# EAGLE design PGTN021_octasource_controls (EAGLE 9.5.0)
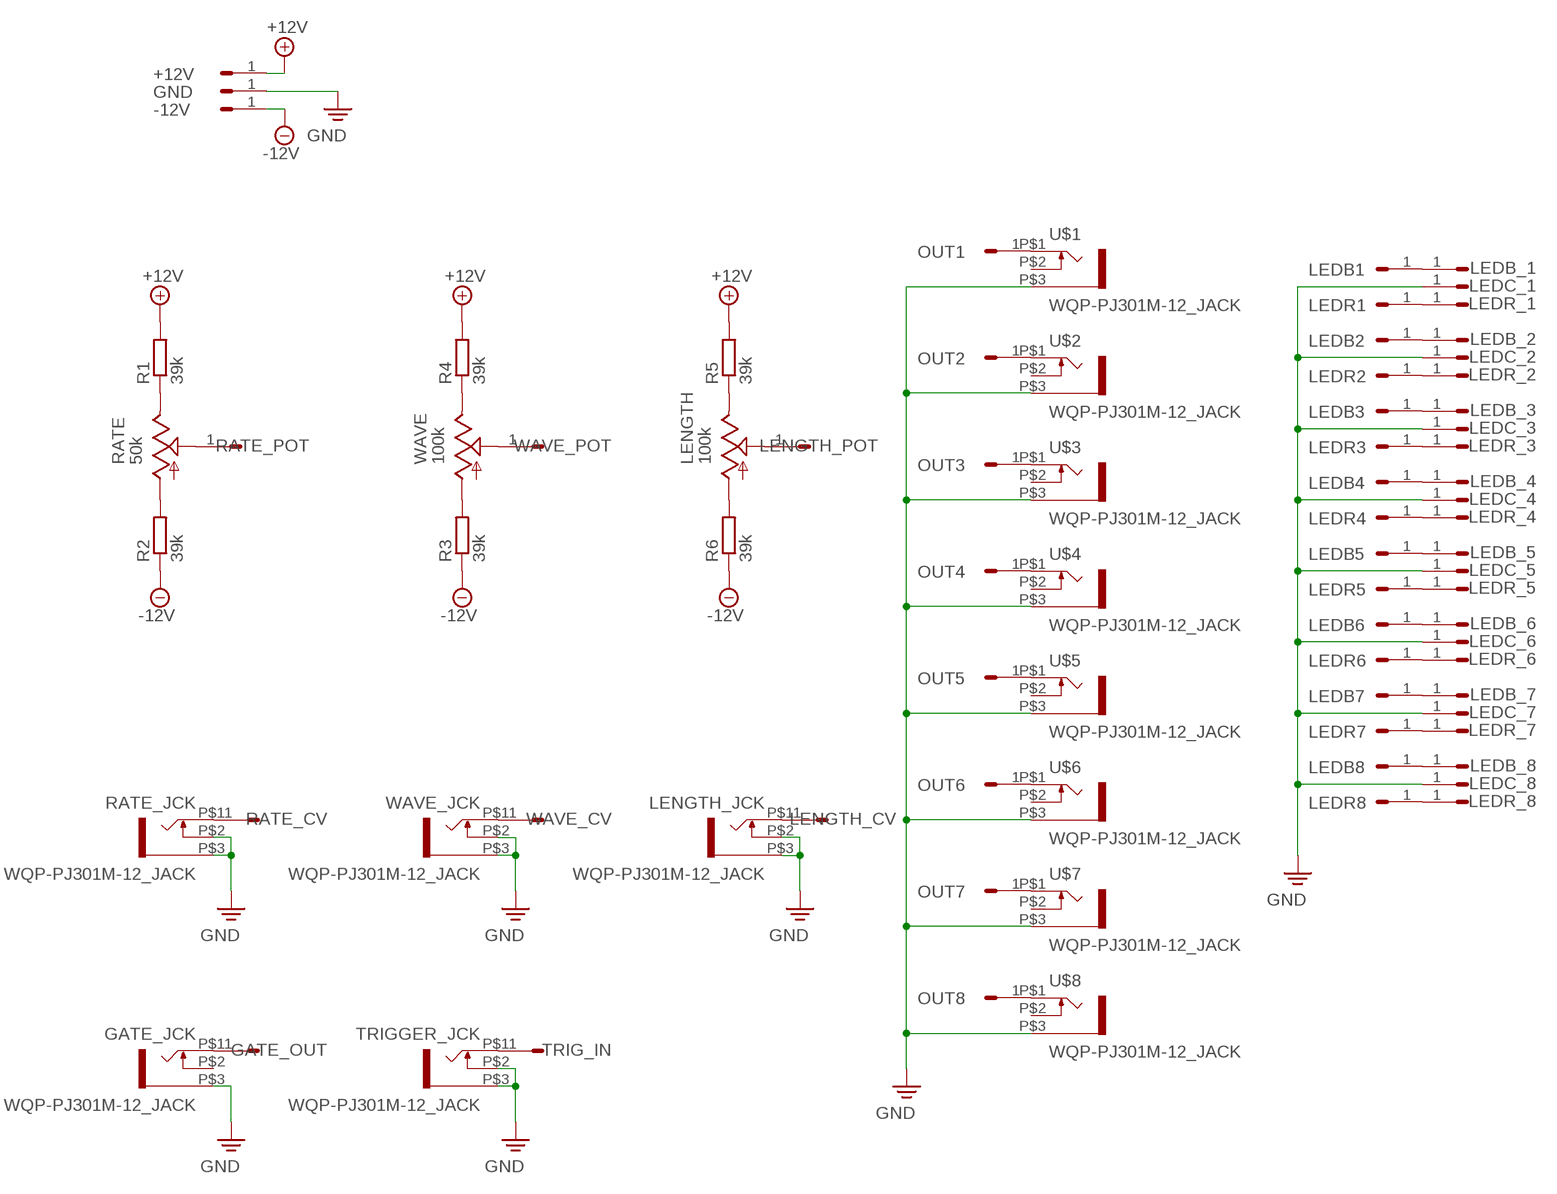
[diagram p0: schematic, sheet 1]

## Parts
+12V  HEADER/MALE/01  [HEADER/MALE/01]
-12V  HEADER/MALE/01  [HEADER/MALE/01]
GATE_JCK  WQP-PJ301M-12_JACK  [WQP-PJ301M-12_JACK]
GATE_OUT  HEADER/MALE/01  [HEADER/MALE/01]
GND  HEADER/MALE/01  [HEADER/MALE/01]
LEDB1  HEADER/MALE/01  [HEADER/MALE/01]
LEDB2  HEADER/MALE/01  [HEADER/MALE/01]
LEDB3  HEADER/MALE/01  [HEADER/MALE/01]
LEDB4  HEADER/MALE/01  [HEADER/MALE/01]
LEDB5  HEADER/MALE/01  [HEADER/MALE/01]
LEDB6  HEADER/MALE/01  [HEADER/MALE/01]
LEDB7  HEADER/MALE/01  [HEADER/MALE/01]
LEDB8  HEADER/MALE/01  [HEADER/MALE/01]
LEDB_1  HEADER/MALE/01  [HEADER/MALE/01]
LEDB_2  HEADER/MALE/01  [HEADER/MALE/01]
LEDB_3  HEADER/MALE/01  [HEADER/MALE/01]
LEDB_4  HEADER/MALE/01  [HEADER/MALE/01]
LEDB_5  HEADER/MALE/01  [HEADER/MALE/01]
LEDB_6  HEADER/MALE/01  [HEADER/MALE/01]
LEDB_7  HEADER/MALE/01  [HEADER/MALE/01]
LEDB_8  HEADER/MALE/01  [HEADER/MALE/01]
LEDC_1  HEADER/MALE/01  [HEADER/MALE/01]
LEDC_2  HEADER/MALE/01  [HEADER/MALE/01]
LEDC_3  HEADER/MALE/01  [HEADER/MALE/01]
LEDC_4  HEADER/MALE/01  [HEADER/MALE/01]
LEDC_5  HEADER/MALE/01  [HEADER/MALE/01]
LEDC_6  HEADER/MALE/01  [HEADER/MALE/01]
LEDC_7  HEADER/MALE/01  [HEADER/MALE/01]
LEDC_8  HEADER/MALE/01  [HEADER/MALE/01]
LEDR1  HEADER/MALE/01  [HEADER/MALE/01]
LEDR2  HEADER/MALE/01  [HEADER/MALE/01]
LEDR3  HEADER/MALE/01  [HEADER/MALE/01]
LEDR4  HEADER/MALE/01  [HEADER/MALE/01]
LEDR5  HEADER/MALE/01  [HEADER/MALE/01]
LEDR6  HEADER/MALE/01  [HEADER/MALE/01]
LEDR7  HEADER/MALE/01  [HEADER/MALE/01]
LEDR8  HEADER/MALE/01  [HEADER/MALE/01]
LEDR_1  HEADER/MALE/01  [HEADER/MALE/01]
LEDR_2  HEADER/MALE/01  [HEADER/MALE/01]
LEDR_3  HEADER/MALE/01  [HEADER/MALE/01]
LEDR_4  HEADER/MALE/01  [HEADER/MALE/01]
LEDR_5  HEADER/MALE/01  [HEADER/MALE/01]
LEDR_6  HEADER/MALE/01  [HEADER/MALE/01]
LEDR_7  HEADER/MALE/01  [HEADER/MALE/01]
LEDR_8  HEADER/MALE/01  [HEADER/MALE/01]
LENGTH  100k  9MM_SNAP-IN_POT_  [9MM_SNAP-IN_POT]
LENGTH_CV  HEADER/MALE/01  [HEADER/MALE/01]
LENGTH_JCK  WQP-PJ301M-12_JACK  [WQP-PJ301M-12_JACK]
LENGTH_POT  HEADER/MALE/01  [HEADER/MALE/01]
OUT1  HEADER/MALE/01  [HEADER/MALE/01]
OUT2  HEADER/MALE/01  [HEADER/MALE/01]
OUT3  HEADER/MALE/01  [HEADER/MALE/01]
OUT4  HEADER/MALE/01  [HEADER/MALE/01]
OUT5  HEADER/MALE/01  [HEADER/MALE/01]
OUT6  HEADER/MALE/01  [HEADER/MALE/01]
OUT7  HEADER/MALE/01  [HEADER/MALE/01]
OUT8  HEADER/MALE/01  [HEADER/MALE/01]
R1  39k  RESISTORRESISTOR/UPRIGHT/7.5  [RESISTOR/7.5]
R2  39k  RESISTORRESISTOR/UPRIGHT/7.5  [RESISTOR/7.5]
R3  39k  RESISTORRESISTOR/UPRIGHT/7.5  [RESISTOR/7.5]
R4  39k  RESISTORRESISTOR/UPRIGHT/7.5  [RESISTOR/7.5]
R5  39k  RESISTORRESISTOR/UPRIGHT/7.5  [RESISTOR/7.5]
R6  39k  RESISTORRESISTOR/UPRIGHT/7.5  [RESISTOR/7.5]
RATE  50k  9MM_SNAP-IN_POT_  [9MM_SNAP-IN_POT]
RATE_CV  HEADER/MALE/01  [HEADER/MALE/01]
RATE_JCK  WQP-PJ301M-12_JACK  [WQP-PJ301M-12_JACK]
RATE_POT  HEADER/MALE/01  [HEADER/MALE/01]
TRIG_IN  HEADER/MALE/01  [HEADER/MALE/01]
TRIGGER_JCK  WQP-PJ301M-12_JACK  [WQP-PJ301M-12_JACK]
U$1  WQP-PJ301M-12_JACK  [WQP-PJ301M-12_JACK]
U$2  WQP-PJ301M-12_JACK  [WQP-PJ301M-12_JACK]
U$3  WQP-PJ301M-12_JACK  [WQP-PJ301M-12_JACK]
U$4  WQP-PJ301M-12_JACK  [WQP-PJ301M-12_JACK]
U$5  WQP-PJ301M-12_JACK  [WQP-PJ301M-12_JACK]
U$6  WQP-PJ301M-12_JACK  [WQP-PJ301M-12_JACK]
U$7  WQP-PJ301M-12_JACK  [WQP-PJ301M-12_JACK]
U$8  WQP-PJ301M-12_JACK  [WQP-PJ301M-12_JACK]
WAVE  100k  9MM_SNAP-IN_POT_  [9MM_SNAP-IN_POT]
WAVE_CV  HEADER/MALE/01  [HEADER/MALE/01]
WAVE_JCK  WQP-PJ301M-12_JACK  [WQP-PJ301M-12_JACK]
WAVE_POT  HEADER/MALE/01  [HEADER/MALE/01]

## Nets
+12V: +12V.1 R1.2 R4.2 R5.2
-12V: -12V.1 R2.1 R3.1 R6.1
N$1: R2.2 RATE.1(A)
N$2: R1.1 RATE.3(E)
N$3: RATE_CV.1 RATE_JCK.P$1
N$4: RATE.2(S) RATE_POT.1
N$5: R3.2 WAVE.1(A)
N$6: R4.1 WAVE.3(E)
N$7: WAVE.2(S) WAVE_POT.1
N$8: LENGTH.3(E) R5.1
N$9: LENGTH.1(A) R6.2
N$10: LENGTH.2(S) LENGTH_POT.1
N$11: LENGTH_CV.1 LENGTH_JCK.P$1
N$12: WAVE_CV.1 WAVE_JCK.P$1
N$13: GATE_JCK.P$1 GATE_OUT.1
N$14: OUT1.1 U$1.P$1
N$15: OUT2.1 U$2.P$1
N$16: OUT3.1 U$3.P$1
N$17: OUT4.1 U$4.P$1
N$18: OUT5.1 U$5.P$1
N$19: OUT6.1 U$6.P$1
N$20: OUT7.1 U$7.P$1
N$21: OUT8.1 U$8.P$1
N$22: LEDB1.1 LEDB_1.1
N$23: LEDB2.1 LEDB_2.1
N$24: LEDB3.1 LEDB_3.1
N$25: LEDB4.1 LEDB_4.1
N$26: LEDB5.1 LEDB_5.1
N$27: LEDB6.1 LEDB_6.1
N$28: LEDB7.1 LEDB_7.1
N$29: LEDB8.1 LEDB_8.1
N$30: LEDR1.1 LEDR_1.1
N$31: LEDR2.1 LEDR_2.1
N$32: LEDR3.1 LEDR_3.1
N$33: LEDR4.1 LEDR_4.1
N$34: LEDR5.1 LEDR_5.1
N$35: LEDR6.1 LEDR_6.1
N$36: LEDR7.1 LEDR_7.1
N$37: LEDR8.1 LEDR_8.1
N$38: TRIG_IN.1 TRIGGER_JCK.P$1
PE: GATE_JCK.P$3 GND.1 LEDC_1.1 LEDC_2.1 LEDC_3.1 LEDC_4.1 LEDC_5.1 LEDC_6.1 LEDC_7.1 LEDC_8.1 LENGTH_JCK.P$2 LENGTH_JCK.P$3 RATE_JCK.P$2 RATE_JCK.P$3 TRIGGER_JCK.P$2 TRIGGER_JCK.P$3 U$1.P$3 U$2.P$3 U$3.P$3 U$4.P$3 U$5.P$3 U$6.P$3 U$7.P$3 U$8.P$3 WAVE_JCK.P$2 WAVE_JCK.P$3 ; supply symbol labelled GND
Unconnected: GATE_JCK.P$2 U$1.P$2 U$2.P$2 U$3.P$2 U$4.P$2 U$5.P$2 U$6.P$2 U$7.P$2 U$8.P$2

## Library data of the parts
+12V -12V GATE_OUT GND LEDB1-LEDB8 LEDB_1-LEDB_8 LEDC_1-LEDC_8 LEDR1-LEDR8 LEDR_1-LEDR_8 LENGTH_CV LENGTH_POT OUT1-OUT8 RATE_CV RATE_POT TRIG_IN WAVE_CV WAVE_POT = connectors:HEADER/MALE/01
GATE_JCK LENGTH_JCK RATE_JCK TRIGGER_JCK U$1-U$8 WAVE_JCK = controls:WQP-PJ301M-12_JACK
LENGTH RATE WAVE = controls:9MM_SNAP-IN_POT: 9mm vertical snap-in pot, Alpha / Panasonic style
R1-R6 = resistors:RESISTOR: RESISTOR, European symbol

## Board
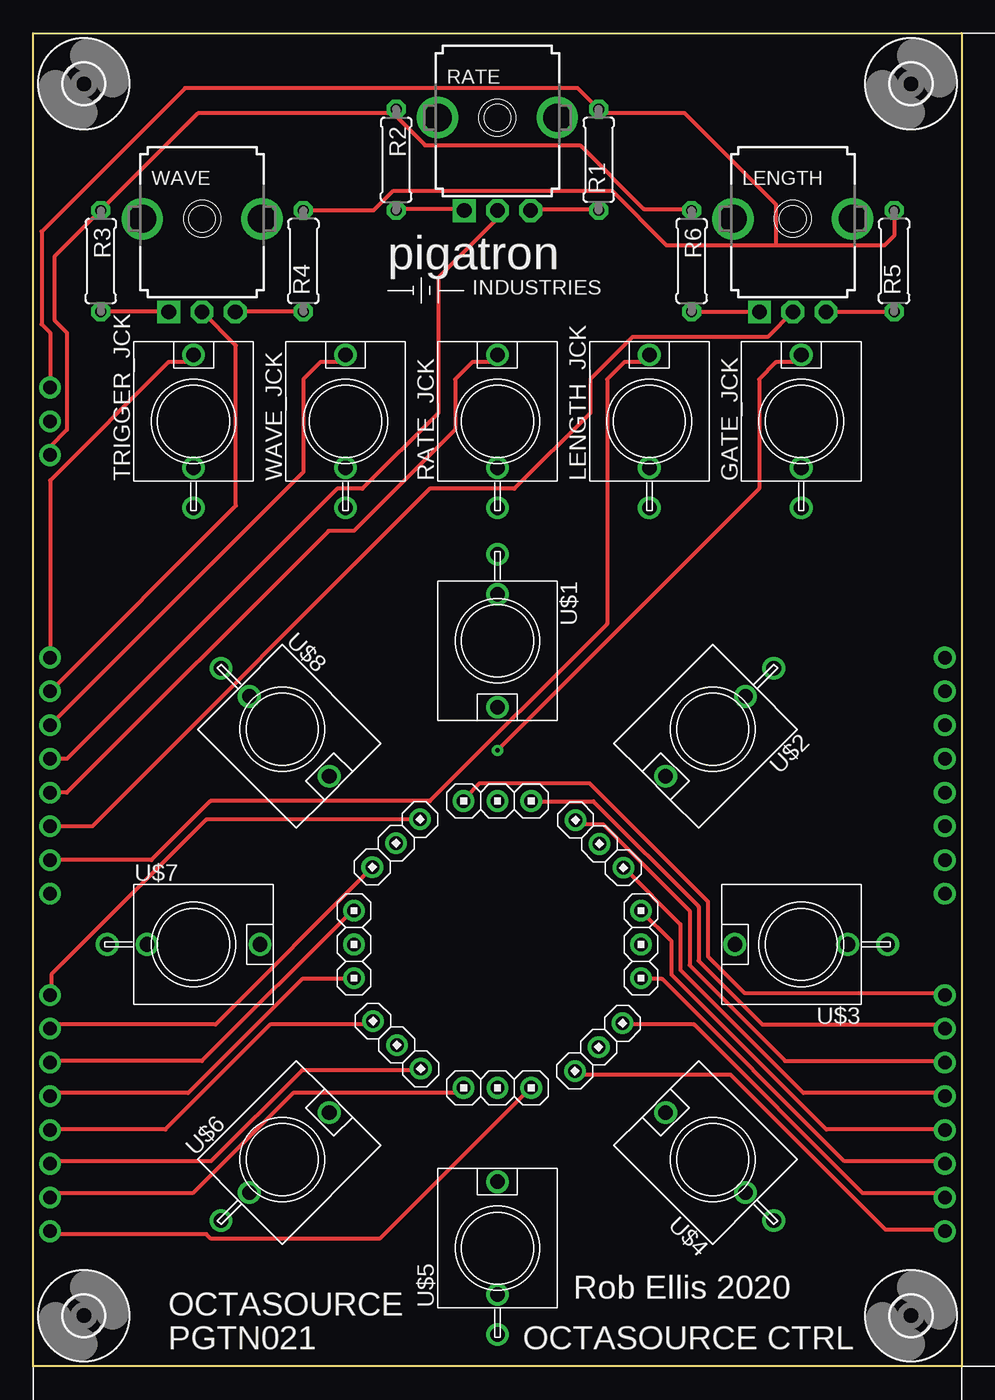
[diagram p1: board, top side]
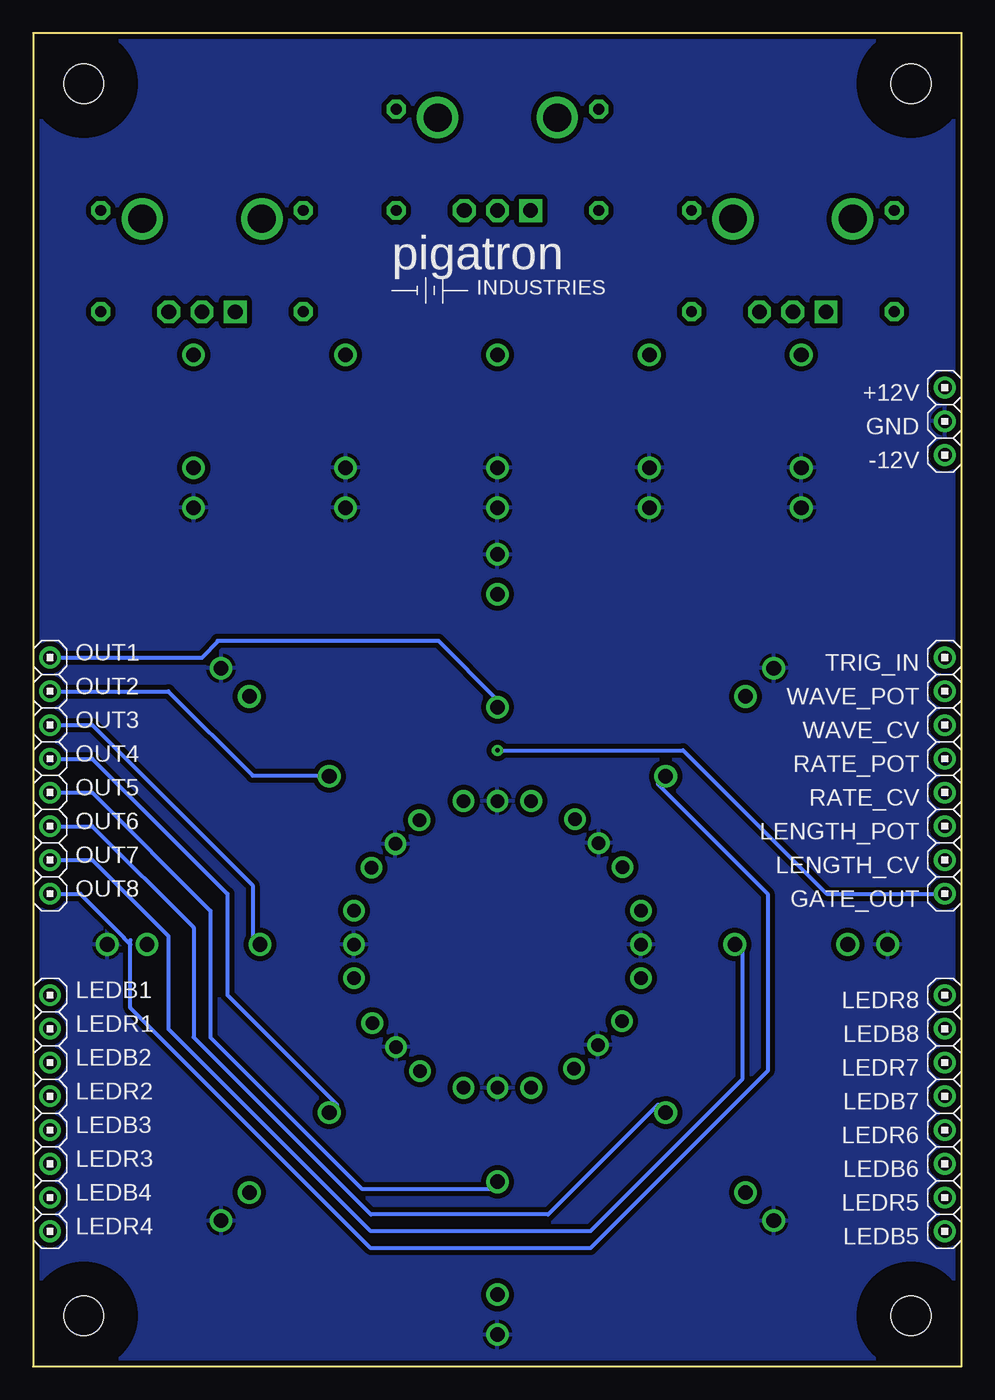
[diagram p2: board, bottom side, seen from below]

Size 69.85 x 100.33 mm. Coordinates in mm from the lower left corner, seen from the top.
Outline: 0,0 0,100.33 69.85,100.33 69.85,0 0,0
Copper layers (1*16): Top 0.0356mm / dielectric 1.5011mm / Bottom 0.0356mm
Design rules "pigatron": minimum track width 12mil, minimum drill 13mil, track to track 15mil, track to pad 10mil, pad to pad 10mil, via to via 10mil, smd to smd 6mil, copper to edge 15mil, drill to drill 10mil, minimum pad ring 12mil, minimum via ring 10mil, stop-mask expansion 4mil, vias tented up to drill 0mil, thermal gap 10mil

### Footprints (pad centres in the part's own frame; a part is rotated, then mirrored left to right if it is on the bottom)
HEADER/MALE/01 = drill 1.016: 1 0,0
WQP-PJ301M-12_JACK = drill 1.1: P$1 0,5; P$2 0,-3.5; P$3 0,-6.5
9MM_SNAP-IN_POT = drill 1.1 square: 1 -2.5,-7 | drill 1.1 octagon: 2 0,-7; 3 2.5,-7 | drill 2.1 pad 2.794: CHASSIS1 -4.5,0; CHASSIS2 4.5,0
RESISTOR/7.5 = drill 0.813 octagon: 1 -3.81,0; 2 3.81,0
STANDOFF/3.0 = hole 3: 0,0

### Placement (x,y rotation side)
+12V  1.27,73.66 180 bottom
-12V  1.27,68.58 180 bottom
GATE_JCK  57.78,71.12 0 top
GATE_OUT  1.27,35.56 180 bottom
GND  1.27,71.12 180 bottom
LEDB1  68.58,27.94 0 bottom
LEDB2  68.58,22.86 0 bottom
LEDB3  68.58,17.78 0 bottom
LEDB4  68.58,12.7 0 bottom
LEDB5  1.27,10.16 180 bottom
LEDB6  1.27,15.24 180 bottom
LEDB7  1.27,20.32 180 bottom
LEDB8  1.27,25.4 180 bottom
LEDB_1  32.38,42.55 90 top
LEDB_2  40.8,41.11 45 top
LEDB_3  45.72,34.29 0 top
LEDB_4  44.34,25.82 315 top
LEDB_5  37.47,20.95 270 top
LEDB_6  29.16,22.39 225 top
LEDB_7  24.13,29.21 180 top
LEDB_8  25.51,37.57 135 top
LEDC_1  34.92,42.55 90 top
LEDC_2  42.6,39.32 45 top
LEDC_3  45.72,31.75 0 top
LEDC_4  42.55,24.02 315 top
LEDC_5  34.92,20.95 270 top
LEDC_6  27.36,24.18 225 top
LEDC_7  24.13,31.75 180 top
LEDC_8  27.31,39.37 135 top
LEDR1  68.58,25.4 0 bottom
LEDR2  68.58,20.32 0 bottom
LEDR3  68.58,15.24 0 bottom
LEDR4  68.58,10.16 0 bottom
LEDR5  1.27,12.7 180 bottom
LEDR6  1.27,17.78 180 bottom
LEDR7  1.27,22.86 180 bottom
LEDR8  1.27,27.94 180 bottom
LEDR_1  37.47,42.55 90 top
LEDR_2  44.4,37.52 45 top
LEDR_3  45.72,29.21 0 top
LEDR_4  40.75,22.23 315 top
LEDR_5  32.38,20.95 270 top
LEDR_6  25.56,25.98 225 top
LEDR_7  24.13,34.29 180 top
LEDR_8  29.1,41.17 135 top
LENGTH  57.15,86.36 0 top
LENGTH_CV  1.27,38.1 180 bottom
LENGTH_JCK  46.35,71.12 0 top
LENGTH_POT  1.27,40.64 180 bottom
OUT1  68.58,53.34 0 bottom
OUT2  68.58,50.8 0 bottom
OUT3  68.58,48.26 0 bottom
OUT4  68.58,45.72 0 bottom
OUT5  68.58,43.18 0 bottom
OUT6  68.58,40.64 0 bottom
OUT7  68.58,38.1 0 bottom
OUT8  68.58,35.56 0 bottom
R1  42.55,90.81 90 top
R2  27.3,90.81 270 top
R3  5.08,83.19 270 top
R4  20.32,83.19 90 top
R5  64.77,83.19 90 top
R6  49.53,83.19 270 top
RATE  34.92,93.98 0 top
RATE_CV  1.27,43.18 180 bottom
RATE_JCK  34.92,71.12 0 top
RATE_POT  1.27,45.72 180 bottom
TRIG_IN  1.27,53.34 180 bottom
TRIGGER_JCK  12.06,71.12 0 top
U$1  34.92,54.61 180 top
U$2  51.12,47.94 135 top
U$3  57.78,31.75 90 top
U$4  51.12,15.56 45 top
U$5  34.92,8.89 0 top
U$6  18.73,15.56 315 top
U$7  12.06,31.75 270 top
U$8  18.73,47.94 225 top
U$9  [STANDOFF/3.0]  3.81,3.81 0 top
U$10  [STANDOFF/3.0]  66.04,3.81 0 top
U$11  [STANDOFF/3.0]  3.81,96.52 0 top
U$12  [STANDOFF/3.0]  66.04,96.52 0 top
U$13  [PIGATRON-LOGO]  35.56,82.55 0 top
U$14  [PIGATRON-LOGO]  33.97,82.55 0 bottom
WAVE  12.7,86.36 0 top
WAVE_CV  1.27,48.26 180 bottom
WAVE_JCK  23.5,71.12 0 top
WAVE_POT  1.27,50.8 180 bottom

### Tracks (layer width: path | path; a pad name or v marks a point on that pad's centre or on a via)
+12V
  Top 0.305: 55.89,84.35 47.66,84.35 43.55,88.47 27.09,88.47 25.62,87 R4.2 | 55.89,84.35 55.89,87.44 49.03,94.3 42.86,94.3 R1.2 40.96,96.2 11.43,96.2 0.64,85.41 0.64,78.42 1.27,77.79 +12V.1 | R5.2 64.77,85.09 64.03,84.35 55.89,84.35
-12V
  Top 0.305: 27.09,94.3 12.38,94.3 R3.1 1.59,83.5 1.59,78.74 2.54,77.79 2.54,70.48 1.27,69.22 -12V.1 | 27.09,94.3 29.49,91.9 41.15,91.9 45.95,87.1 49.43,87.1 R6.1 | 27.09,94.3 R2.1
N$1
  Top 0.305: R2.2 27.43,87.1 32.23,87.1 RATE.1
N$2
  Top 0.305: R1.1 42.52,87.1 37.72,87.1 RATE.3
N$3
  Top 0.305: RATE_CV.1 2.54,43.18 22.23,62.87 24.13,62.87 31.75,70.48 31.75,74.3 33.02,75.56 34.92,75.56 RATE_JCK.P$1
N$4
  Top 0.305: RATE_POT.1 2.54,45.72 22.86,66.04 24.77,66.04 30.48,71.75 30.48,81.92 34.92,86.36 RATE.2
N$5
  Top 0.305: WAVE.1 5.09,79.36 R3.2
N$6
  Top 0.305: R4.1 15.21,79.38 WAVE.3
N$7
  Top 0.305: WAVE_POT.1 15.24,64.77 15.24,76.82 WAVE.2
N$8
  Top 0.305: LENGTH.3 64.75,79.36 R5.1
N$9
  Top 0.305: R6.2 54.63,79.38 LENGTH.1
N$10
  Top 0.305: LENGTH_POT.1 4.45,40.64 29.84,66.04 36.2,66.04 41.91,71.75 41.91,74.3 45.09,77.47 55.26,77.47 LENGTH.2
N$11
  Top 0.305: LENGTH_CV.1 8.89,38.1 13.34,42.55 29.84,42.55 43.18,55.88 43.18,74.3 44.45,75.56 46.35,75.56 LENGTH_JCK.P$1
N$12
  Top 0.305: WAVE_CV.1 20.32,67.31 20.32,74.3 21.59,75.56 23.5,75.56 WAVE_JCK.P$1
N$13  (via drill 0.33)
  Top 0.305: v34.92,46.35 54.61,66.04 54.61,74.3 55.88,75.56 57.78,75.56 GATE_JCK.P$1
  Bottom 0.305: GATE_OUT.1 10.16,35.56 20.95,46.35 v34.92,46.35
N$14
  Bottom 0.305: 34.92,49.53 U$1.P$1 34.92,50.16 39.37,54.61 55.88,54.61 | OUT1.1 57.15,53.34 55.88,54.61 | 56,54.61 55.88,54.61
N$15
  Bottom 0.305: U$2.P$1 47.62,44.45 53.34,44.45 59.69,50.8 OUT2.1
N$16
  Bottom 0.305: U$3.P$1 53.34,31.75 53.34,36.2 65.41,48.26 OUT3.1
N$17
  Bottom 0.305: U$4.P$1 46.99,19.68 55.24,27.94 55.24,35.56 65.41,45.72 OUT4.1
N$18
  Bottom 0.305: U$5.P$1 34.92,13.34 45.09,13.34 56.52,24.77 56.52,34.29 65.41,43.18 OUT5.1
N$19
  Bottom 0.305: U$6.P$1 22.86,19.68 31.11,11.43 44.45,11.43 57.78,24.77 57.78,33.02 65.41,40.64 OUT6.1
N$20
  Bottom 0.305: U$7.P$1 16.51,31.75 16.51,21.59 27.94,10.16 44.45,10.16 59.69,25.4 59.69,32.38 65.41,38.1 OUT7.1
N$21
  Bottom 0.305: U$8.P$1 22.86,43.81 14.61,35.56 14.61,22.23 27.94,8.89 44.45,8.89 62.55,26.99 62.55,31.75 | 62.55,31.75 62.55,32.07 | 62.55,31.75 63.02,32.23 63.02,32.27 66.31,35.56 OUT8.1
N$22
  Top 0.305: LEDB1.1 68.58,28.12 53.49,28.12 50.75,30.86 50.75,34.98 41.83,43.89 33.6,43.89 32.58,42.86 LEDB_1.1
N$23
  Top 0.305: LEDB2.1 68.58,22.97 56.58,22.97 49.38,30.18 49.38,34.29 42.86,40.8 40.8,40.8 LEDB_2.1
N$24
  Top 0.305: LEDB3.1 68.58,17.83 59.66,17.83 48.01,29.49 48.01,32 LEDB_3.1
N$25
  Top 0.305: LEDB_4.1 44.58,25.72 49.72,25.72 62.41,13.03 68.58,13.03 LEDB4.1
N$26
  Top 0.305: LEDB5.1 1.37,9.94 13.03,9.94 13.37,9.6 26.06,9.6 37.38,20.92 LEDB_5.1
N$27
  Top 0.305: LEDB6.1 1.37,15.43 13.37,15.43 20.23,22.29 29.15,22.29 LEDB_6.1
N$28
  Top 0.305: LEDB7.1 1.37,20.57 11.66,20.57 20.23,29.15 24,29.15 LEDB_7.1
N$29
  Top 0.305: LEDB8.1 1.37,25.72 13.72,25.72 25.38,37.38 LEDB_8.1
N$30
  Top 0.305: LEDR1.1 68.58,25.72 54.86,25.72 50.06,30.52 50.06,34.61 42.15,42.52 37.72,42.52 LEDR_1.1
N$31
  Top 0.305: LEDR_2.1 44.58,37.38 48.69,33.26 48.69,29.83 57.95,20.57 68.58,20.57 LEDR2.1
N$32
  Top 0.305: LEDR_3.1 45.95,29.15 47.32,29.15 61.04,15.43 68.58,15.43 LEDR3.1
N$33
  Top 0.305: LEDR_4.1 40.8,21.95 52.46,21.95 64.12,10.29 68.58,10.29 LEDR4.1
N$34
  Top 0.305: LEDR5.1 1.37,13.03 12,13.03 19.55,20.57 31.89,20.57 32.23,20.92 LEDR_5.1
N$35
  Top 0.305: LEDR6.1 1.37,17.83 9.94,17.83 17.83,25.72 25.38,25.72 LEDR_6.1
N$36
  Top 0.305: LEDR7.1 1.37,22.97 12.69,22.97 24,34.29 LEDR_7.1
N$37
  Top 0.305: LEDR8.1 1.37,28.12 1.37,29.49 13.03,41.15 28.8,41.15 LEDR_8.1
N$38
  Top 0.305: TRIG_IN.1 1.27,66.67 10.16,75.56 12.06,75.56 TRIGGER_JCK.P$1
PE
  pour Bottom: 0,100.33 0,0 69.85,0 69.85,100.33

### Text on the board
tNames: Rob Ellis 2020 | OCTASOURCE | PGTN021 | OCTASOURCE CTRL